# EAGLE design RdL_main_v05 (EAGLE 7.6.0)
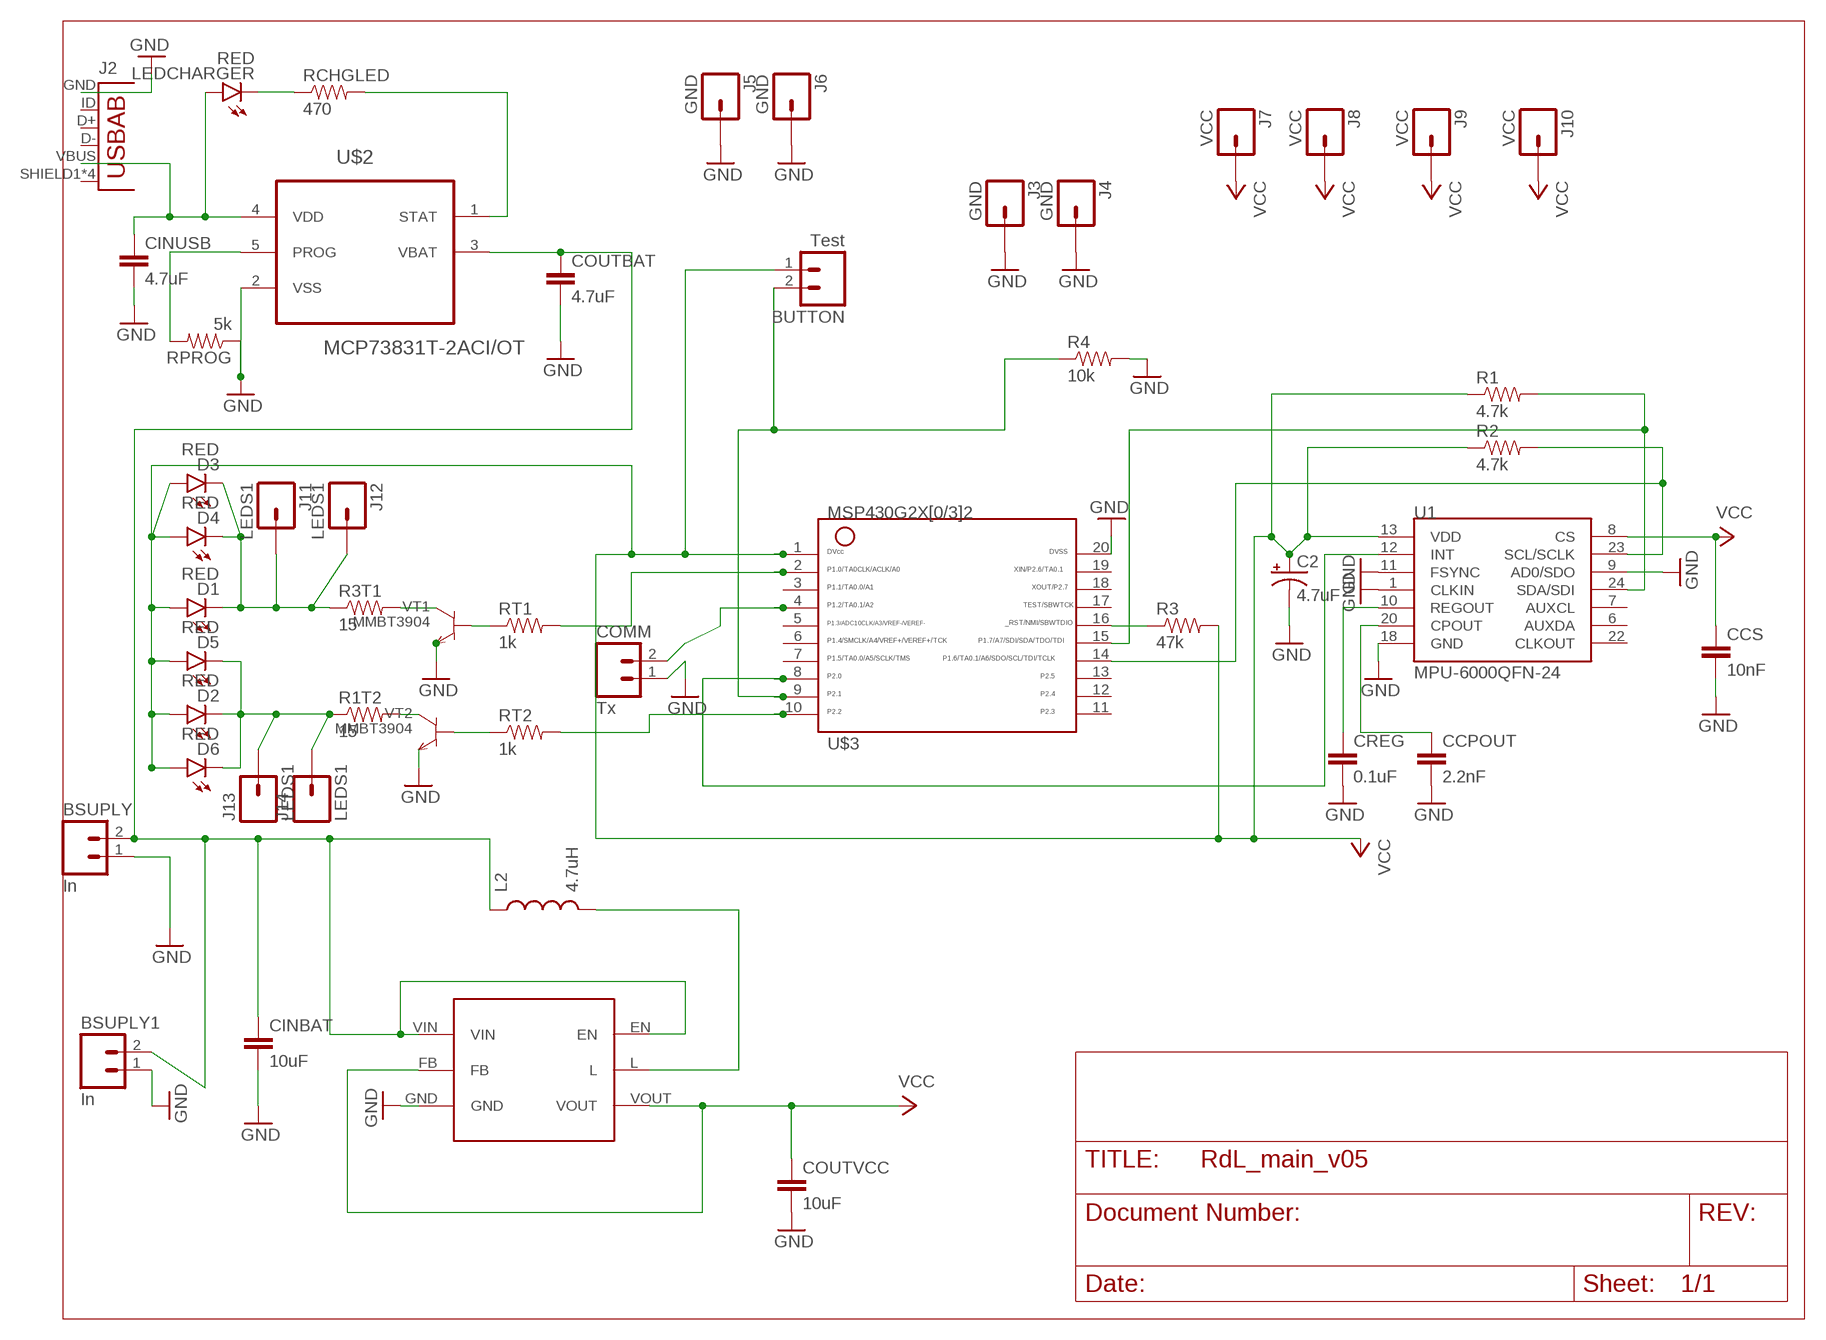
[diagram p0: schematic, sheet 1]

## Parts
BSUPLY  In  M02PTH  [1X02]
BSUPLY1  In  M02PTH  [1X02]
BUTTON  Test  M02PTH  [1X02]
C2  4.7uF  10UF-16V-10%(TANT)  [EIA3216]
CCPOUT  2.2nF  CAP0805  [0805]
CCS  10nF  CAP0805  [0805]
CINBAT  10uF  CAP0805  [0805]
CINUSB  4.7uF  CAP0805  [0805]
COMM  Tx  M02PTH  [1X02]
COUTBAT  4.7uF  CAP0805  [0805]
COUTVCC  10uF  CAP0805  [0805]
CREG  0.1uF  CAP0805  [0805]
D1  RED  LED-RED1206  [LED-1206]
D2  RED  LED-RED1206  [LED-1206]
D3  RED  LED-RED1206  [LED-1206]
D4  RED  LED-RED1206  [LED-1206]
D5  RED  LED-RED1206  [LED-1206]
D6  RED  LED-RED1206  [LED-1206]
J2  USB-AB  [USB-AB-MICRO-SMD]
J3  GND  M01PTH  [1X01]
J4  GND  M01PTH  [1X01]
J5  GND  M01PTH  [1X01]
J6  GND  M01PTH  [1X01]
J7  VCC  M01PTH  [1X01]
J8  VCC  M01PTH  [1X01]
J9  VCC  M01PTH  [1X01]
J10  VCC  M01PTH  [1X01]
J11  LEDS1  M01PTH  [1X01]
J12  LEDS1  M01PTH  [1X01]
J13  LEDS1  M01PTH  [1X01]
J14  LEDS1  M01PTH  [1X01]
L2  4.7uH  INDUCTORINDUCTOR_4.7UH  [INDUCTOR_4.7UH]
LEDCHARGER  RED  LED-RED1206  [LED-1206]
R1  4.7k  RESISTOR1206  [1206]
R1T2  15  RESISTOR1206  [1206]
R2  4.7k  RESISTOR1206  [1206]
R3  47k  RESISTOR1206  [1206]
R3T1  15  RESISTOR1206  [1206]
R4  10k  RESISTOR1206  [1206]
RCHGLED  470  RESISTOR1206  [1206]
RPROG  5k  RESISTOR1206  [1206]
RT1  1k  RESISTOR1206  [1206]
RT2  1k  RESISTOR1206  [1206]
U1  MPU-6000QFN-24  [QFN-24-TESTING]
U$1  TLV61225  [TLV61225DCKT]
U$2  MCP73831T-2ACI/OT  [SOT95P280X145-5N]
U$3  G2X[0/3]2---PW20  [PW20]
VT1  MMBT3904  [SOT23-BEC]
VT2  MMBT3904  [SOT23-BEC]

## Nets
GND: BSUPLY1.1 BSUPLY.1 C2.C(-) CCPOUT.2 CCS.2 CINBAT.2 CINUSB.2 COMM.1 COUTBAT.2 COUTVCC.2 CREG.2 J2.GND J3.1 J4.1 J5.1 J6.1 R4.2 RPROG.1 U1.1(CLKIN) U1.9(AD0/SDO) U1.11(FSYNC) U1.18(GND) U$1.GND U$2.2(VSS) U$3.20 VT1.E VT2.E
N$1: BUTTON.2 R4.1 U$3.9
N$3: L2.P$2 U$1.L
N$5: CINUSB.1 J2.VBUS LEDCHARGER.A U$2.4(VDD)
N$6: R1T2.2 VT2.C
N$7: R3T1.2 VT1.C
N$8: RT1.1 VT1.B
N$9: RT2.1 VT2.B
N$10: RT1.2 U$3.2
N$11: RT2.2 U$3.10
N$12: R3.1 U$3.16
N$13: D2.C D5.C D6.C J13.1 J14.1 R1T2.1
N$14: D1.C D3.C D4.C J11.1 J12.1 R3T1.1
N$15: COMM.2 U$3.4
N$16: LEDCHARGER.C RCHGLED.1
N$18: U1.12(INT) U$3.8
N$19: RPROG.2 U$2.5(PROG)
N$20: R1.2 U1.24(SDA/SDI) U$3.15
N$22: R2.2 U1.23(SCL/SCLK) U$3.14
N$23: CREG.1 U1.10(REGOUT)
N$26: CCPOUT.1 U1.20(CPOUT)
VCC: BUTTON.1 C2.A(+) CCS.1 COUTVCC.1 D1.A D2.A D3.A D4.A D5.A D6.A J7.1 J8.1 J9.1 J10.1 R1.1 R2.1 R3.2 U1.8(CS) U1.13(VDD) U$1.FB U$1.VOUT U$3.1
VINUSB: RCHGLED.2 U$2.1(STAT)
VOUTBATT: BSUPLY1.2 BSUPLY.2 CINBAT.1 COUTBAT.1 L2.P$1 U$1.EN U$1.VIN U$2.3(VBAT)
Unconnected: J2.D+ J2.D- J2.ID(USBID) J2.SHIELD1(SHIELD) J2.SHIELD2(SHIELD) J2.SHIELD3(SHIELD) J2.SHIELD4(SHIELD) U1.6(AUXDA) U1.7(AUXCL) U1.22(CLKOUT) U$3.3 U$3.5 U$3.6 U$3.7 U$3.11 U$3.12 U$3.13 U$3.17 U$3.18 U$3.19

## Library data of the parts
BSUPLY BSUPLY1 BUTTON COMM = SparkFun-Connectors:M02: Standard 2-pin 0.1" header. Use with - straight break away headers ( PRT-00116) - right angle break away headers (PRT-00553) - swiss pins (PRT-00743) - machine pins (PRT-00117) - female headers (PRT-00115) Molex polarized connector foot print use with: PRT-08233 with associated crimp pins and housings. 2.54_SCREWTERM for use with PRT-10571. 3.5mm Screw Terminal footprints for PRT-08084 5mm Screw Terminal footprints for use with PRT-08432
C2 = SparkFun-Capacitors:10UF-16V-10%(TANT): CAP-00811 1206/EIA-3216 Tantalum capacitor; PROD_ID: CAP-00811; VALUE: 10uF
CCPOUT CCS CINBAT CINUSB COUTBAT COUTVCC CREG = SparkFun-Capacitors:CAP: Capacitor Standard 0603 ceramic capacitor, and 0.1" leaded capacitor.
D1-D6 LEDCHARGER = SparkFun-LED:LED-RED: Assorted Red LEDs LilyPad 1206- DIO-09912 1206- DIO-00809 0603- DIO-00819 "SMART" means more efficient and expensive; PROD_ID: DIO-09912
J2 = SparkFun-Connectors:USB-AB: This is a USB AB connector that is compatible with USB OTG. i.e. this connector can serve as a host or device
J3-J14 = SparkFun-Connectors:M01: Header 1 Standard 1-pin 0.1" header. Use with straight break away headers (SKU : PRT-00116), right angle break away headers (PRT-00553), swiss pins (PRT-00743), machine pins (PRT-00117), and female headers (PRT-00115). SMTSO-256-ET is a "flush mount" nut for a 4-40 screw. The older package used to be too tight, and did not allow it to sit properly thru the drill hit. The latest (0.165DIA) fits nice and snug.
L2 = SparkFun-Passives:INDUCTOR: Inductors Basic Inductor/Choke - 0603 and 1206. Footprints are not proven and vary greatly between part numbers. INDUCTOR POWER 3.3UH 4.0A SMD 0.197" L x 0.197" W x 0.177" H (5.00mm x 5.00mm x 4.50mm); PROD_ID: NDUC-10146
R1 R1T2 R2 R3 R3T1 R4 RCHGLED RPROG RT1 RT2 = SparkFun-Resistors:RESISTOR: Resistor Basic schematic elements and footprints for 0603, 1206, and PTH resistors.
U1 = SparkFun-Sensors:MPU-6000: MPU-6000 - I2C address is 0x68 with AD0 low and 0x69 with AD0 high.
U$1 = TLV61225DCKT:TLV61225: TLV61225 Single-Cell High-Efficient Step-up Converter
U$2 = MCP73831T-2ACI_OT:MCP73831T-2ACI/OT: Charge Management Controller; MPN: MCP73831T-2ACI/OT; OC_FARNELL: 1332158; OC_NEWARK: 56K7045; PACKAGE: SOT-5; SUPPLIER: Microchip
U$3 = TI_MSP430_v16:G2X[0/3]2---PW20: MSP430G2X[0/3]2 MSP430G2x32, MSP430G2x02 TSSOP (PW) 20 Pin Package http://focus.ti.com/docs/prod/folders/print/msp430g2432.html
VT1 VT2 = transistor-npn:MMBT3904*: NPN TRANSISTOR

## Net classes
0 default: clearance 0.205 mm

## Board
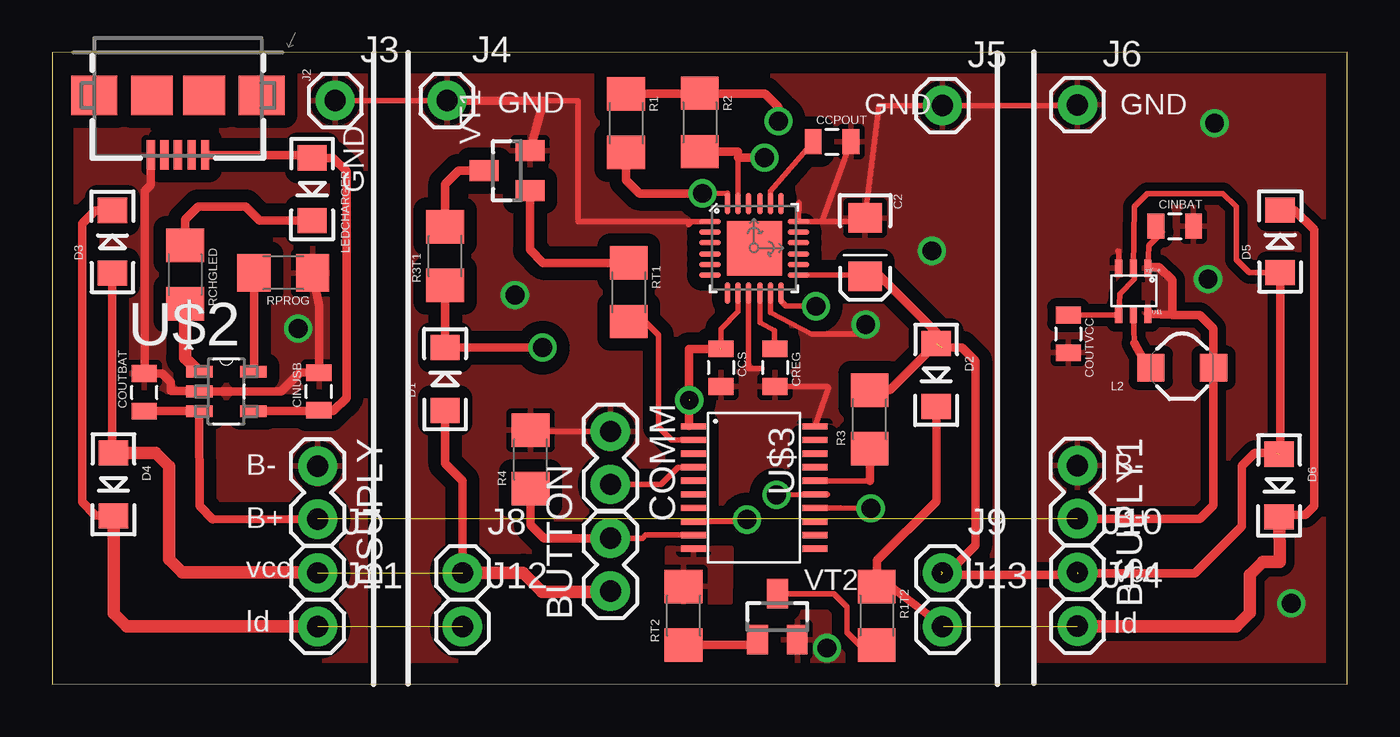
[diagram p1: board, top side]
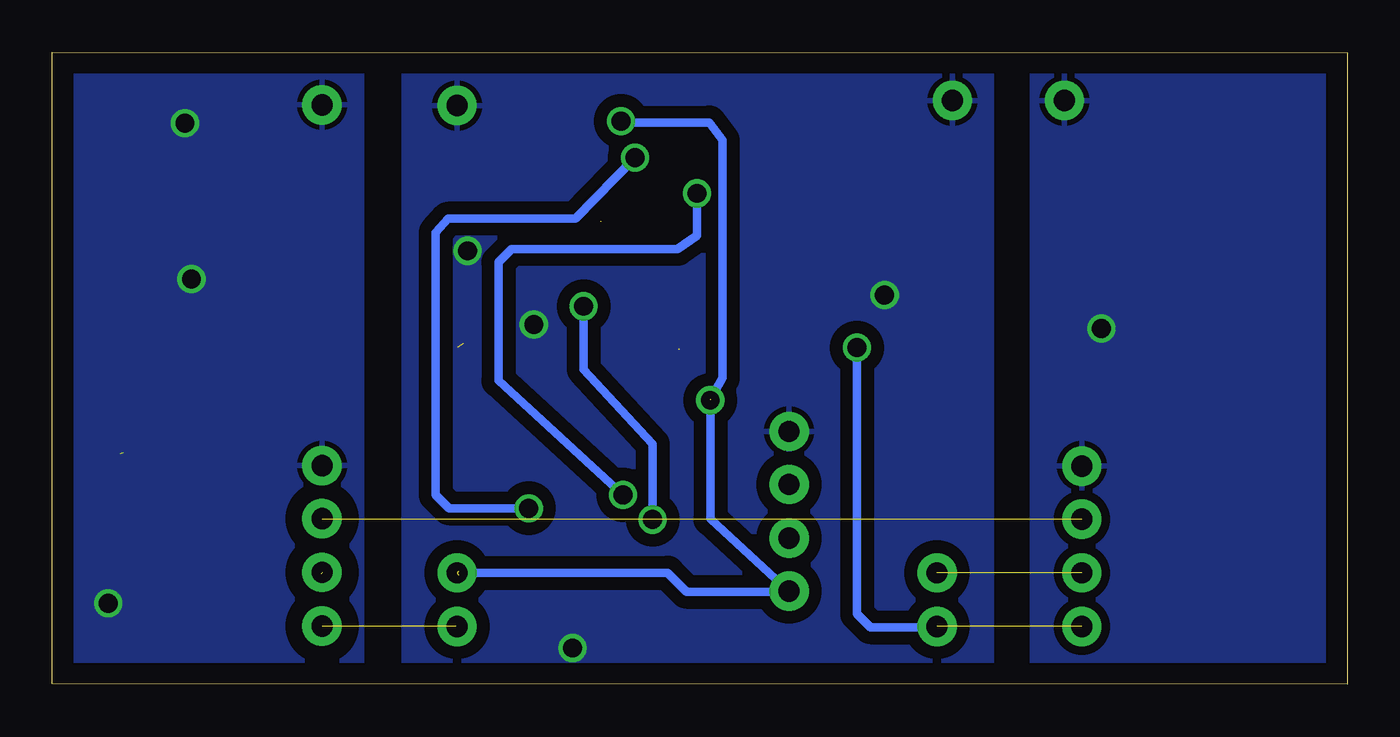
[diagram p2: board, bottom side, seen from below]

Size 61.97 x 30.26 mm. Coordinates in mm from the lower left corner, seen from the top.
Outline: 0,0 61.97,0.02 61.97,30.26 0,30.24 0,0
Copper layers (1*16): Top 0.035mm / dielectric 1.5mm / Bottom 0.035mm
Design rules "default": minimum track width 10mil, minimum drill 24mil, track to track 8mil, track to pad 8mil, pad to pad 8mil, via to via 8mil, smd to smd 8mil, copper to edge 40mil, drill to drill 8mil, minimum pad ring 10mil, minimum via ring 8mil, stop-mask expansion 4mil, vias tented up to drill 0mil, thermal gap 10mil

### Footprints (pad centres in the part's own frame; a part is rotated, then mirrored left to right if it is on the bottom)
1X02 = drill 1.016 pad 1.88: 1 0,0; 2 2.54,0
EIA3216 = smd 1.4 x 1.6: A 1.4,0; C -1.4,0
0805 = smd 0.8 x 1.2: 1 -0.9,0; 2 0.9,0
LED-1206 = smd 1.2 x 1.4: A -1.5,0; C 1.5,0
USB-AB-MICRO-SMD = smd 1.4 x 0.4: D+ 2.85,0; D- 2.85,0.65; GND 2.85,-1.3; ID 2.85,-0.65; VBUS 2.85,1.3 | smd 1.9 x 2.2: SHIELD1 0,4; SHIELD4 0,-4 | smd 1.9 x 2: SHIELD2 0,1.25; SHIELD3 0,-1.25
1X01 = drill 1.016 pad 1.88: 1 0,0
INDUCTOR_4.7UH = smd 1.3 x 1.3: P$1 -1.5,0; P$2 1.5,0
1206 = smd 1.6 x 1.8: 1 -1.4,0; 2 1.4,0
QFN-24-TESTING = smd 1.016 x 0.254: 1 -2.1,1.257; 2 -2.1,0.75; 3 -2.1,0.247; 4 -2.1,-0.287; 5 -2.1,-0.792; 6 -2.1,-1.297; 13 2.12,-1.297; 14 2.12,-0.792; 15 2.12,-0.287; 16 2.12,0.247; 17 2.12,0.75; 18 2.12,1.257 | smd 0.254 x 1.016: 7 -1.267,-2.155; 8 -0.762,-2.155; 9 -0.258,-2.155; 10 0.278,-2.155; 11 0.78,-2.155; 12 1.287,-2.155; 19 1.287,2.115; 20 0.78,2.115; 21 0.278,2.115; 22 -0.258,2.115; 23 -0.762,2.115; 24 -1.267,2.115 | smd 2.616 x 2.616: P$1 0.02,-0.01
TLV61225DCKT = smd 0.35 x 0.85: EN -3,2.2; FB -2.3,0; GND -1.6,0; L -2.3,2.2; VIN -3,0; VOUT -1.6,2.2
SOT95P280X145-5N = smd 1.27 x 0.559: 1 -1.295,0.94; 2 -1.295,0; 3 -1.295,-0.94; 4 1.295,-0.94; 5 1.295,0.94
PW20 = smd 0.3 x 1.2: 1 -2.925,-2.9; 2 -2.275,-2.9; 3 -1.625,-2.9; 4 -0.975,-2.9; 5 -0.325,-2.9; 6 0.325,-2.9; 7 0.975,-2.9; 8 1.625,-2.9; 9 2.275,-2.9; 10 2.925,-2.9; 11 2.925,2.9; 12 2.275,2.9; 13 1.625,2.9; 14 0.975,2.9; 15 0.325,2.9; 16 -0.325,2.9; 17 -0.975,2.9; 18 -1.625,2.9; 19 -2.275,2.9; 20 -2.925,2.9
SOT23-BEC = smd 1 x 1.4: B -0.95,-1.1; C 0,1.1; E 0.95,-1.1

### Placement (x,y rotation side)
BSUPLY  12.7,10.45 270 top
BSUPLY1  49.06,10.47 270 top
BUTTON  26.71,4.46 90 top
C2  38.9,20.93 270 top
CCPOUT  37.32,25.97 0 top
CCS  32,15.16 270 top
CINBAT  53.71,21.93 0 top
CINUSB  12.76,14.02 90 top
COMM  26.71,12.11 270 top
COUTBAT  4.41,13.98 90 top
COUTVCC  48.62,16.78 270 top
CREG  34.59,15.16 270 top
D1  18.8,14.62 90 top
D2  42.3,14.81 270 top
D3  2.88,21.19 90 top
D4  2.93,9.57 270 top
D5  58.76,21.21 90 top
D6  58.71,9.52 270 top
J2  6.02,28.19 270 top
J3  13.54,27.95 0 top
J4  18.89,27.95 0 top
J5  42.6,27.71 0 top
J6  49.06,27.74 0 top
J7  12.7,5.34 0 top
J8  19.63,5.34 0 top
J9  42.6,5.34 0 top
J10  49.06,5.36 0 top
J11  12.7,2.77 0 top
J12  19.63,2.77 0 top
J13  42.6,2.77 0 top
J14  49.06,2.79 0 top
L2  54.07,15.16 180 top
LEDCHARGER  12.44,23.7 270 top
R1  27.46,26.87 270 top
R1T2  39.45,3.29 270 top
R2  30.99,26.9 270 top
R3  39.11,12.69 90 top
R3T1  18.8,20.5 90 top
R4  22.89,10.77 90 top
RCHGLED  6.36,19.61 270 top
RPROG  11.06,19.7 180 top
RT1  27.58,18.77 270 top
RT2  30.21,3.29 90 top
U1  33.58,20.89 0 top
U$1  49.43,19.92 180 top
U$2  8.33,14.02 0 top
U$3  33.59,9.42 270 top
VT1  21.76,24.59 90 top
VT2  34.7,3.24 0 top

### Tracks (layer width: path | path; a pad name or v marks a point on that pad's centre or on a via)
GND  (via drill 0.9)  (1 unrouted)
  Top 0.254: J3.1 J4.1 | U1.18 36.84,22.15 | 36.84,22.15 CCPOUT.2 | 36.84,22.15 39.55,22.15 C2.C 39.55,27.71 J5.1 48.99,27.71 J6.1 | COMM.1 23.6,12.11 R4.2 | 30.45,22.01 30.59,22.15 U1.1 25.15,22.15 25.15,27.95 23.51,27.95 | U1.11 34.37,17.8 36.33,16.76 38.77,16.76 v38.93,17.23 | U1.9 33.32,15.13 33.97,15.13 | U$3.20 37.14,14.19 37.07,14.26 CREG.2 | 51.03,20.11 51.03,20.74 51,20.74 | 35.72,22.17 35.73,23.05
  Top 0.406: RPROG.1 12.76,18.12 CINUSB.2 11.86,14.93 10.95,14.02 U$2.2 7.01,14.04 5.68,14.04 5.66,14.06 5.66,14.47 5.25,14.88 COUTBAT.2 4.43,14.9 4.43,23.61 4.72,23.9 J2.GND | J4.1 23.51,27.95 VT1.E
  other vias: 11.77,17.04 59.29,3.88 55.31,19.4 55.62,26.86 37.07,1.74 42.09,20.75 22.14,18.64
  pour Top (isolate 0.61): 0.29,30.06 14.97,30.06 14.97,0.04 0.29,0.04
  pour Bottom (isolate 0.406): 0.19,30.21 15.07,30.21 15.07,0.09 0.19,0.09
  pour Top (isolate 0.406): 47.16,29.75 61.59,29.75 61.59,0.36 47.16,0.36
  pour Bottom (isolate 0.813): 47.16,29.72 61.59,29.72 61.59,0.32 47.16,0.32
  pour Top (isolate 0.61): 17.03,30.56 45.22,30.56 45.22,-0.44 17.03,-0.44
  pour Bottom (isolate 0.61): 17.03,30.55 45.13,30.55 45.13,-0.39 17.02,-0.39
N$1
  Top 0.254: U$3.9 28.39,7.14 28.24,6.99 BUTTON.2
  Top 0.406: R4.1 22.89,7.63 23.52,7 BUTTON.2
N$3
  Top 0.254: U$1.L 51.78,16.34 | 52.46,15.12 L2.P$2
  Top 0.406: 51.78,16.34 52.46,15.12
N$5
  Top 0.406: J2.VBUS 12.44,25.34 LEDCHARGER.A 13.45,25.2 14.08,24.57 14.08,13.71 13.45,13.08 12.76,13.08 CINUSB.1 12.72,13.08 U$2.4
N$6
  Top 0.254: VT2.C 37.41,4.34 38.04,3.71 38.04,2.48 38.67,1.85 39.41,1.85 R1T2.2
N$7
  Top 0.406: R3T1.2 18.8,23.95 19.43,24.59 VT1.C
N$8
  Top 0.406: VT1.B 22.86,20.8 23.5,20.17 RT1.1
N$9
  Top 0.254: 33.5,1.89 VT2.B
  Top 0.406: RT2.1 33.5,1.89
N$10
  Top 0.254: U$3.2 29.64,11.7 29.01,12.33 29.01,16.73 28.38,17.37 RT1.2
N$11
  Top 0.254: 30.21,6.5 U$3.10
  pour Top: 29.44,6.51 32.47,6.52 32.44,3.93 29.42,3.95
N$12
  Top 0.254: U$3.16 39.14,9.74
  Top 0.406: 39.14,9.74 R3.1
N$13  (1 unrouted)
  Top 0.254: D5.C 59.44,22.71 | 58.78,8.12 D6.C | 40.17,4.65 R1T2.1 39.33,4.38
  Top 0.406: 59.44,22.71 60.39,21.76 60.39,8.54 59.97,8.12 58.78,8.12 | J13.1 42.65,2.77 40.17,4.65 | D2.C 42.3,8.77 39.46,5.93 R1T2.1
  Top 0.61: D6.C 58.75,5.87 57.94,5.87 57.3,5.24 57.3,3.42 56.66,2.79 J14.1
N$14  (via drill 0.9)  (1 unrouted)
  Top 0.406: D3.C 2.06,22.69 1.43,22.05 1.43,8.72 2.06,8.09 2.93,8.09 D4.C | R3T1.1 D1.C v23.46,16.12
  Top 0.61: D4.C 2.93,3.4 3.56,2.77 J11.1
  Bottom 0.254: 20.28,2.74 J12.1
  Bottom 0.406: v23.46,16.12 23.46,3.38 22.82,2.74 20.28,2.74
N$15
  Top 0.254: U$3.4 29.94,10.39 29.12,9.58 27.36,9.58 COMM.2
N$16
  Top 0.406: LEDCHARGER.C 9.93,22.2 9.25,22.88 7,22.88 6.36,22.25 RCHGLED.1
N$18  (via drill 0.9)
  Top 0.254: U1.12 34.87,18.42 34.87,18.35 35.12,18.1 v36.54,18.1 | v33.24,7.89 33.15,7.8 31.34,7.8 U$3.8
  Bottom 0.406: v36.54,18.1 36.54,15.08 33.24,11.5 v33.24,7.89
N$19
  Top 0.406: U$2.5 9.66,14.96 RPROG.2
N$20  (via drill 0.9)
  Top 0.254: U1.24 32.32,23.51 v31.11,23.5 | v34.65,9.07 37.09,9.1 U$3.15
  Top 0.406: R1.2 27.46,24.14 28.09,23.5 v31.11,23.5
  Bottom 0.406: v31.11,23.5 31.11,21.48 32.05,20.84 39.98,20.84 40.62,20.2 40.62,14.54 v34.65,9.07
N$22  (via drill 0.9)
  Top 0.254: 32.82,25.5 32.82,25.21 U1.23 | v39.17,8.43 39.22,8.41 37.72,8.45 U$3.14
  Top 0.406: 32.82,25.5 R2.2 | 32.82,25.21 v34.08,25.21
  Bottom 0.406: v34.08,25.21 36.92,22.29 43.03,22.29 43.62,21.63 43.62,9.06 42.98,8.43 v39.17,8.43
N$23
  Top 0.254: U1.10 33.87,17.32 34.56,16.93 34.56,16.03 CREG.1
N$26
  Top 0.254: U1.20 34.36,23.6 CCPOUT.1
VCC  (via drill 0.9)  (9 unrouted)
  Top 0.254: COUTVCC.1 51.09,17.68 U$1.VOUT 51.08,18.7 51.78,19.39 U$1.FB 51.78,22.86 52.41,23.5 56.02,23.5 56.65,22.86 56.65,20.34 57.28,19.71 D5.A | 58.76,11.1 D6.A | U1.13 39.55,19.59 C2.A | U$3.1 30.48,12.36 | U1.8 32.82,17.84 32,17.02 CCS.1 | 42.57,16.12 42.57,16.57
  Top 0.406: D5.A 58.76,11.1 | D4.A 2.88,11.07 D3.A | 12.7,5.36 J7.1 | 58.57,11.09 57.55,11.09 56.92,10.46 56.92,7.57 54.67,5.32 49.09,5.32 | R1.1 31.64,28.27 | 31.64,28.27 R2.1 | 30.48,12.36 v30.48,13.6 | 30.48,13.63 30.48,16.05 31.95,16.06 | 31.64,28.27 34.12,28.27 34.75,27.64 v34.75,26.96 | 42.53,5.25 49.08,5.25 49.08,5.29 | R3.2 40.08,14.09 D2.A | J8.1 19.63,9.75 18.81,10.57 D1.A | 42.57,16.12 43.53,16.12 44.17,15.48 44.17,6.66 42.93,5.42 42.53,5.42 | 42.57,16.57 39.55,19.59
  Top 0.61: D4.A 4.96,11.07 5.59,10.44 5.59,6 6.22,5.36 12.7,5.36 | J8.1 22.54,5.34 23.43,4.44 25.76,4.44 BUTTON.1
  Bottom 0.254: 27.38,4.44 BUTTON.1 | v34.75,26.96 34.85,26.9 | 30.5,13.61 v30.48,13.6
  Bottom 0.406: J9.1 32.52,5.34 31.62,4.44 27.38,4.44 | v30.48,13.6 30.48,7.92 BUTTON.1 | 34.85,26.9 30.52,26.9 29.89,26.05 29.89,14.65 30.5,13.61
VINUSB
  Top 0.61: RCHGLED.2 6.36,15.63 U$2.1
VOUTBATT  (1 unrouted)
  Top 0.254: U$1.VIN 52.48,19.98 | 52.47,19.89 U$1.VIN | CINBAT.1 53.12,21.64 52.48,21 U$1.VIN
  Top 0.406: COUTBAT.1 U$2.3 7.04,8.54 7.68,7.9 BSUPLY.2 | 52.48,19.98 52.95,19.98 53.59,19.34 53.59,17.68 | 53.59,17.68 U$1.EN | 53.59,17.68 54.91,17.68 55.55,17.05 L2.P$1 55.55,8.56 54.91,7.93 BSUPLY1.2
  pour Top: 52.25,19.98 52.25,17.8 53.64,17.73 53.64,19.24 53.49,19.24 53.49,19.28 53.03,19.28 53.03,19.97 52.51,19.97

### Text on the board
tPlace: GND | GND | GND | GND | B- | B- | B+ | B+ | vcc | vcc | ld | ld